# EAGLE design monkeyprintBoard (EAGLE 6.2)
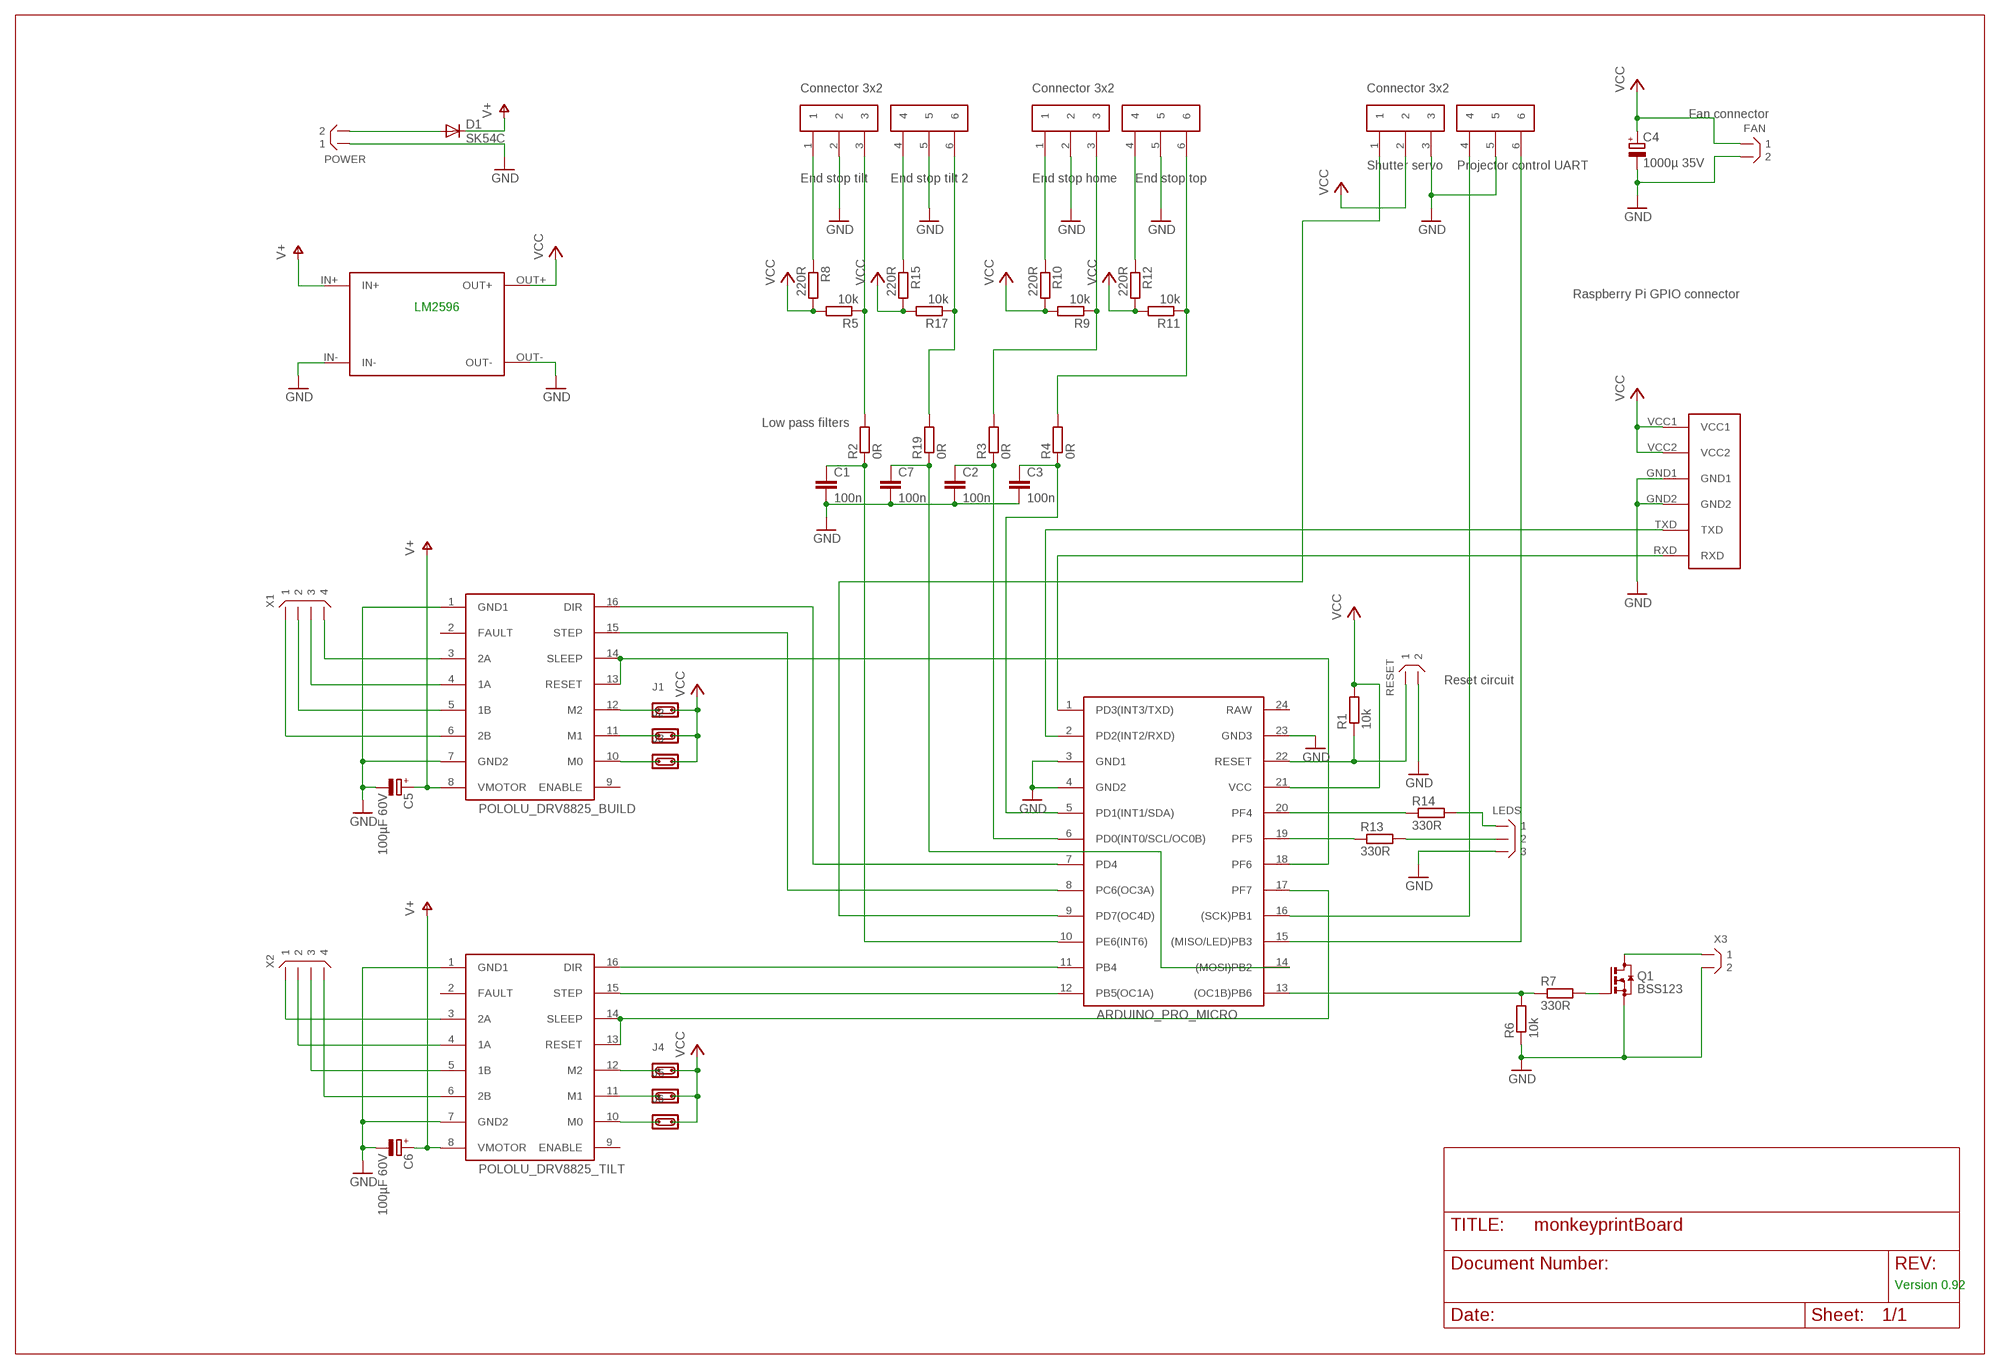
[diagram p0: schematic, sheet 1]

## Parts
ARDUINO_PRO_MICRO  ARDUINOPROMICRO  [ARDUINOPROMICRO]
C1  100n  C-EUC0603  [C0603]
C2  100n  C-EUC0603  [C0603]
C3  100n  C-EUC0603  [C0603]
C4  1000µ 35V  CPOL-EUE5-10.5  [E5-10,5]
C5  100µF 60V  CPOL-EUE5-10.5  [E5-10,5]
C6  100µF 60V  CPOL-EUE5-10.5  [E5-10,5]
C7  100n  C-EUC0603  [C0603]
D1  SK54C  DIODE-SMC  [SMC]
FAN  X02  [X02N-SIL]
J1  JP02  [JP02N]
J2  JP02  [JP02N]
J3  JP02  [JP02N]
J4  JP02  [JP02N]
J5  JP02  [JP02N]
J6  JP02  [JP02N]
LEDS  X03  [X03N-SIL]
POLOLU_DRV8825_BUILD  POLOLU8825  [POLOLU8825]
POLOLU_DRV8825_TILT  POLOLU8825  [POLOLU8825]
POWER  X02  [X02N-SIL]
Q1  BSS123  [SOT23]
R1  10k  R-EU_R0603  [R0603]
R2  0R  R-EU_R0603  [R0603]
R3  0R  R-EU_R0603  [R0603]
R4  0R  R-EU_R0603  [R0603]
R5  10k  R-EU_R0603  [R0603]
R6  10k  R-EU_R0603  [R0603]
R7  330R  R-EU_R0603  [R0603]
R8  220R  R-EU_R0603  [R0603]
R9  10k  R-EU_R0603  [R0603]
R10  220R  R-EU_R0603  [R0603]
R11  10k  R-EU_R0603  [R0603]
R12  220R  R-EU_R0603  [R0603]
R13  330R  R-EU_R0603  [R0603]
R14  330R  R-EU_R0603  [R0603]
R15  220R  R-EU_R0603  [R0603]
R17  10k  R-EU_R0603  [R0603]
R19  0R  R-EU_R0603  [R0603]
RESET  X02  [X02N-SIL]
U$1  MONKEYPRINTPICONNECTOR  [MONKEYPRINTPICONNECTOR]
U$4  LM2596MODULEUPRIGHT  [LM2596MODULEUPRIGHT]
U$5  CON3X2  [CONNECTOR3X2]
U$6  CON3X2  [CONNECTOR3X2]
U$7  CON3X2  [CONNECTOR3X2]
X1  X04  [X04N-SIL]
X2  X04  [X04N-SIL]
X3  X02  [X02N-SIL]

## Nets
GND: ARDUINO_PRO_MICRO.3(GND1) ARDUINO_PRO_MICRO.4(GND2) ARDUINO_PRO_MICRO.23(GND3) C1.2 C2.2 C3.2 C4.- C5.- C6.- C7.2 FAN.2 LEDS.3 POLOLU_DRV8825_BUILD.1(GND1) POLOLU_DRV8825_BUILD.7(GND2) POLOLU_DRV8825_TILT.1(GND1) POLOLU_DRV8825_TILT.7(GND2) POWER.1 Q1.2(S) R6.1 RESET.2 U$1.GND1 U$1.GND2 U$4.IN- U$4.OUT- U$5.2 U$5.5 U$6.2 U$6.5 U$7.3 U$7.5 X3.2
N$1: ARDUINO_PRO_MICRO.7(PD4) POLOLU_DRV8825_BUILD.16(DIR)
N$2: ARDUINO_PRO_MICRO.8(PC6(OC3A)) POLOLU_DRV8825_BUILD.15(STEP)
N$3: R2.2 R5.1 U$6.3
N$4: ARDUINO_PRO_MICRO.12(PB5(OC1A)) POLOLU_DRV8825_TILT.15(STEP)
N$5: ARDUINO_PRO_MICRO.18(PF6) POLOLU_DRV8825_BUILD.13(RESET) POLOLU_DRV8825_BUILD.14(SLEEP)
N$6: ARDUINO_PRO_MICRO.11(PB4) POLOLU_DRV8825_TILT.16(DIR)
N$7: R3.2 R9.1 U$5.3
N$8: ARDUINO_PRO_MICRO.17(PF7) POLOLU_DRV8825_TILT.13(RESET) POLOLU_DRV8825_TILT.14(SLEEP)
N$9: R4.2 R11.1 U$5.6
N$10: R8.1 U$6.1
N$11: R10.1 U$5.1
N$12: ARDUINO_PRO_MICRO.5(PD1(INT1/SDA)) C3.1 R4.1
N$13: ARDUINO_PRO_MICRO.6(PD0(INT0/SCL/OC0B)) C2.1 R3.1
N$14: R12.1 U$5.4
N$15: POLOLU_DRV8825_BUILD.3(2A) X1.4
N$16: POLOLU_DRV8825_BUILD.4(1A) X1.3
N$17: POLOLU_DRV8825_BUILD.5(1B) X1.2
N$18: POLOLU_DRV8825_TILT.3(2A) X2.1
N$19: POLOLU_DRV8825_TILT.4(1A) X2.2
N$20: POLOLU_DRV8825_TILT.5(1B) X2.3
N$21: POLOLU_DRV8825_TILT.6(2B) X2.4
N$22: J6.1 POLOLU_DRV8825_TILT.10(M0)
N$23: J5.1 POLOLU_DRV8825_TILT.11(M1)
N$24: J4.1 POLOLU_DRV8825_TILT.12(M2)
N$25: ARDUINO_PRO_MICRO.10(PE6(INT6)) C1.1 R2.1
N$26: ARDUINO_PRO_MICRO.1(PD3(INT3/TXD)) U$1.RXD
N$27: ARDUINO_PRO_MICRO.13((OC1B)PB6) R6.2 R7.1
N$28: ARDUINO_PRO_MICRO.22(RESET) R1.1 RESET.1
N$29: ARDUINO_PRO_MICRO.16((SCK)PB1) U$7.4
N$30: Q1.1(G) R7.2
N$31: Q1.3(D) X3.1
N$32: ARDUINO_PRO_MICRO.19(PF5) R13.1
N$33: ARDUINO_PRO_MICRO.21(VCC) R1.2 ; supply symbol labelled VCC
N$34: ARDUINO_PRO_MICRO.20(PF4) R14.1
N$35: LEDS.2 R13.2
N$36: LEDS.1 R14.2
N$37: ARDUINO_PRO_MICRO.2(PD2(INT2/RXD)) U$1.TXD
N$38: ARDUINO_PRO_MICRO.15((MISO/LED)PB3) U$7.6
N$39: ARDUINO_PRO_MICRO.9(PD7(OC4D)) U$7.1
N$40: D1.A POWER.2
N$41: R15.1 U$6.4
N$42: POLOLU_DRV8825_BUILD.6(2B) X1.1
N$43: C5.+ POLOLU_DRV8825_BUILD.8(VMOTOR) ; supply symbol labelled V+
N$44: J3.1 POLOLU_DRV8825_BUILD.10(M0)
N$45: J2.1 POLOLU_DRV8825_BUILD.11(M1)
N$46: J1.1 POLOLU_DRV8825_BUILD.12(M2)
N$49: R17.1 R19.2 U$6.6
N$50: ARDUINO_PRO_MICRO.14((MOSI)PB2) C7.1 R19.1
V+: C6.+ D1.C POLOLU_DRV8825_TILT.8(VMOTOR) U$4.IN+
VCC: C4.+ FAN.1 J1.2 J2.2 J3.2 J4.2 J5.2 J6.2 R5.2 R8.2 R9.2 R10.2 R11.2 R12.2 R15.2 R17.2 U$1.VCC1 U$1.VCC2 U$4.OUT+ U$7.2
Unconnected: ARDUINO_PRO_MICRO.24(RAW) POLOLU_DRV8825_BUILD.2(FAULT) POLOLU_DRV8825_BUILD.9(ENABLE) POLOLU_DRV8825_TILT.2(FAULT) POLOLU_DRV8825_TILT.9(ENABLE)

## Notes on the sheet
- Fan connector
- Shutter servo | Projector control UART
- End stop tilt | End stop tilt 2 | End stop home | End stop top
- Raspberry Pi GPIO connector
- LM2596
- Low pass filters
- Reset circuit
- Version 0.92

## Library data of the parts
ARDUINO_PRO_MICRO = arduinoProMicro:ARDUINOPROMICRO
C1-C3 C7 = rcl:C-EU: CAPACITOR, European symbol
C4-C6 = rcl:CPOL-EU: POLARIZED CAPACITOR, European symbol
D1 = diode:DIODE-: DIODE
FAN POWER RESET X3 = connectors:X02: Connector 2 pins
J1-J6 = connectors:JP02: Jumper 2 pins
LEDS = connectors:X03: Connector 3 pins
POLOLU_DRV8825_BUILD POLOLU_DRV8825_TILT = pololu8825:POLOLU8825
Q1 = transistor-small-signal:BSS123: N-CHANNEL MOS FET
R1-R15 R17 R19 = rcl:R-EU_: RESISTOR, European symbol
U$1 = monkeyprintPiConnector:MONKEYPRINTPICONNECTOR
U$4 = lm2596Module:LM2596MODULE
U$5-U$7 = connectorsPaul:CON3X2
X1 X2 = connectors:X04: Connector 4 pins

## Board
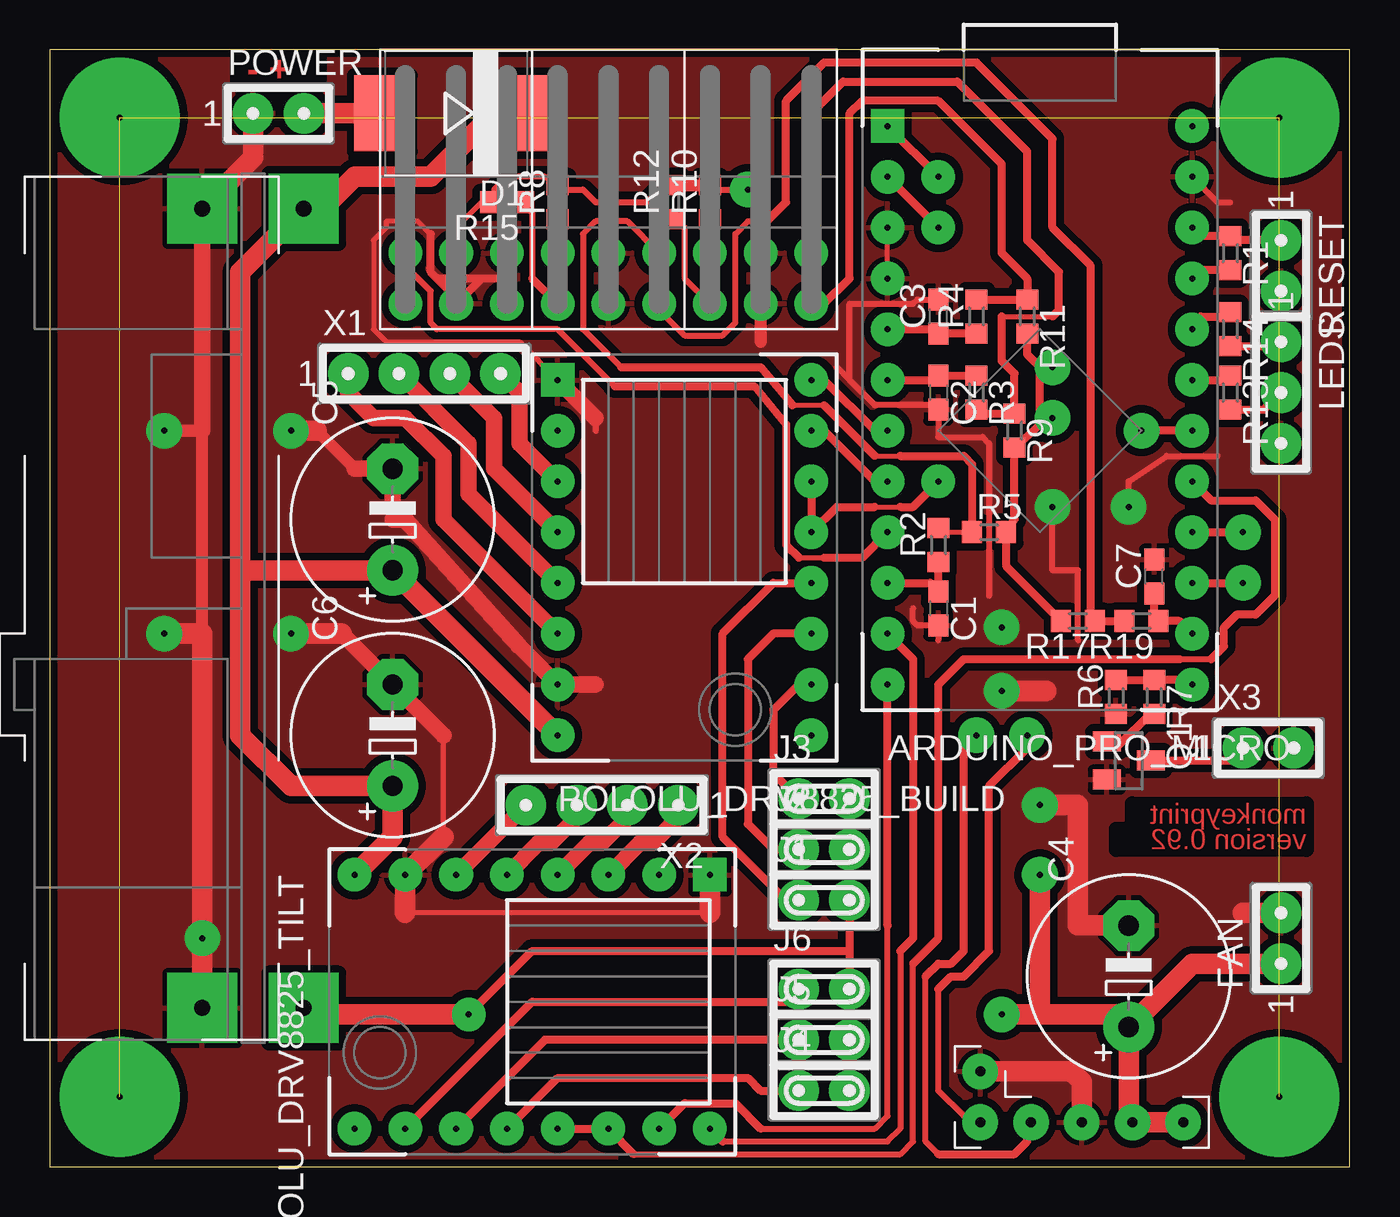
[diagram p1: board, top side]
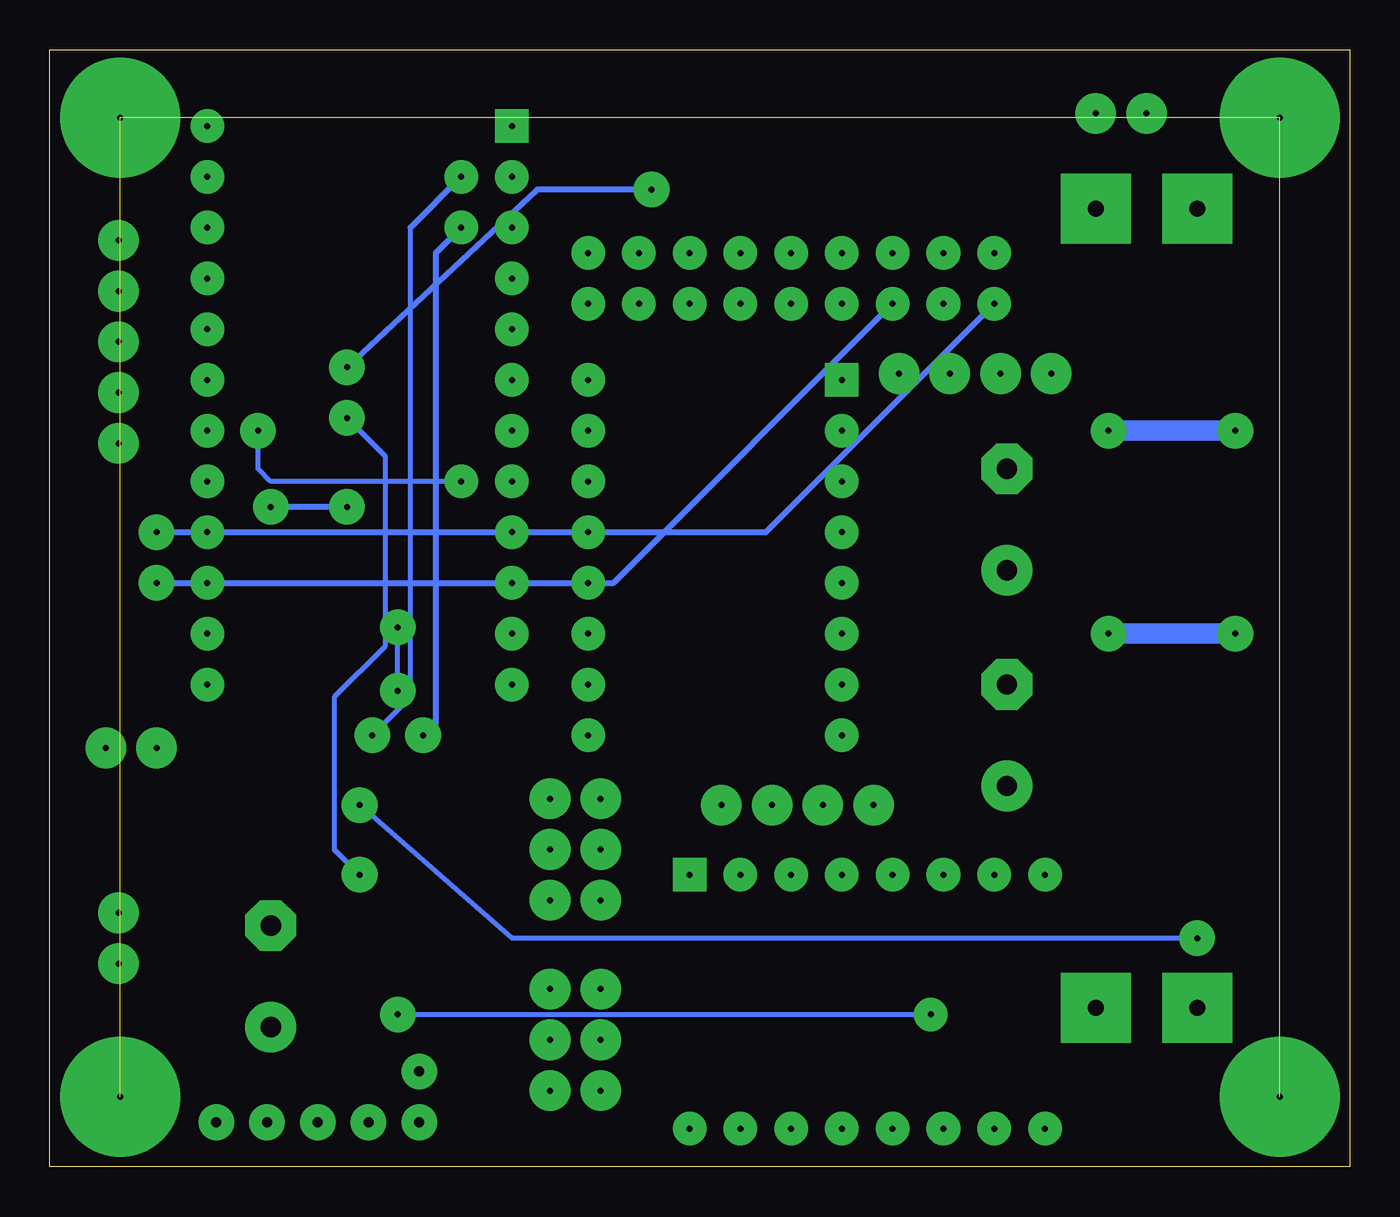
[diagram p2: board, bottom side, seen from below]

Size 65.02 x 55.88 mm. Coordinates in mm from the lower left corner, seen from the top.
Outline: 0,0 65.02,0 65.02,55.88 0,55.88 0,0
Copper layers (1*16): Top 0.035mm / dielectric 1.5mm / Bottom 0.035mm
Design rules: minimum track width 10mil, minimum drill 0.6mm, track to track 8mil, track to pad 8mil, pad to pad 8mil, via to via 8mil, smd to smd 8mil, copper to edge 10mil, drill to drill 8mil, minimum pad ring 10mil, minimum via ring 8mil, stop-mask expansion 4mil, vias tented up to drill 0mil, thermal gap 10mil
tRestrict: area 9.5,54.3 to 13.3,55.6

### Footprints (pad centres in the part's own frame; a part is rotated, then mirrored left to right if it is on the bottom)
ARDUINOPROMICRO = drill 0.3 pad 1.676 square: 1 -7.62,12.7 | drill 0.3 pad 1.676: 2 -7.62,10.16; 3 -7.62,7.62; 4 -7.62,5.08; 5 -7.62,2.54; 6 -7.62,0; 7 -7.62,-2.54; 8 -7.62,-5.08; 9 -7.62,-7.62; 10 -7.62,-10.16; 11 -7.62,-12.7; 12 -7.62,-15.24; 13 7.62,-15.24; 14 7.62,-12.7; 15 7.62,-10.16; 16 7.62,-7.62; 17 7.62,-5.08; 18 7.62,-2.54; 19 7.62,0; 20 7.62,2.54; 21 7.62,5.08; 22 7.62,7.62; 23 7.62,10.16; 24 7.62,12.7
C0603 = smd 1.1 x 1: 1 -0.85,0; 2 0.85,0
E5-10,5 = drill 1.016 pad 2.54: + -2.54,0 | drill 1.016 pad 2.54 octagon: - 2.54,0
SMC = smd 2.8 x 3.8: A 3.7,0; C -3.7,0
X02N-SIL = drill 0.3 pad 2.032: 1 -1.27,0; 2 1.27,0
JP02N = drill 0.3 pad 2.032: 1 -1.27,0; 2 1.27,0
X03N-SIL = drill 0.3 pad 2.032: 1 -2.54,0; 2 0,0; 3 2.54,0
POLOLU8825 = drill 0.3 pad 1.676 square: 1 -6.35,8.89 | drill 0.3 pad 1.676: 2 -6.35,6.35; 3 -6.35,3.81; 4 -6.35,1.27; 5 -6.35,-1.27; 6 -6.35,-3.81; 7 -6.35,-6.35; 8 -6.35,-8.89; 9 6.35,-8.89; 10 6.35,-6.35; 11 6.35,-3.81; 12 6.35,-1.27; 13 6.35,1.27; 14 6.35,3.81; 15 6.35,6.35; 16 6.35,8.89
SOT23 = smd 1 x 1.4: 1 -0.95,-1.1; 2 0.95,-1.1; 3 0,1.1
R0603 = smd 1 x 1.1: 1 -0.85,0; 2 0.85,0
MONKEYPRINTPICONNECTOR = drill 0.5 pad 1.778: GND1 0,-1.27; GND2 -5.08,1.27; RXD -5.08,-1.27; TXD -2.54,-1.27; VCC1 5.08,-1.27; VCC2 2.54,-1.27
LM2596MODULEUPRIGHT = drill 0.8 pad 3.5 square: IN+ -20,2.54 | drill 0.8 pad 3.505 square: IN- -20,-2.54; OUT+ 20,2.54; OUT- 20,-2.54
CONNECTOR3X2 = drill 0.3 pad 1.676: 1 -2.54,0; 2 0,0; 3 2.54,0; 4 -2.54,-2.54; 5 0,-2.54; 6 2.54,-2.54
X04N-SIL = drill 0.3 pad 2.032: 1 -3.81,0; 2 -1.27,0; 3 1.27,0; 4 3.81,0

### Placement (x,y rotation side)
ARDUINO_PRO_MICRO  49.53,39.37 0 top
C1  44.45,27.94 270 top
C2  44.45,38.73 270 top
C3  44.45,42.55 90 top
C4  53.98,9.53 90 top
C5  17.14,32.38 90 top
C6  17.14,21.59 90 top
C7  55.24,29.53 90 top
D1  20.32,52.7 180 top
FAN  61.59,11.43 90 top
J1  38.73,13.34 0 top
J2  38.73,15.88 0 top
J3  38.73,18.41 0 top
J4  38.73,3.81 0 top
J5  38.73,6.35 0 top
J6  38.73,8.89 0 top
LEDS  61.59,38.73 270 top
POLOLU_DRV8825_BUILD  31.75,30.48 0 top
POLOLU_DRV8825_TILT  24.13,8.26 270 top
POWER  11.43,52.7 0 top
Q1  53.98,20.32 270 top
R1  59.05,45.72 270 top
R2  44.45,31.11 90 top
R3  46.35,38.73 270 top
R4  46.35,42.55 90 top
R5  46.99,31.75 0 top
R6  53.34,23.5 90 top
R7  55.24,23.5 270 top
R8  25.4,48.26 90 top
R9  48.26,36.83 270 top
R10  33.02,48.26 90 top
R11  48.9,42.55 270 top
R12  31.11,48.26 90 top
R13  59.05,38.73 270 top
R14  59.05,41.91 270 top
R15  22.86,48.26 180 top
R17  51.44,27.3 180 top
R19  54.61,27.3 180 top
RESET  61.59,45.09 270 top
U$1  51.63,3.49 0 top
U$4  10.16,27.94 270 top
U$5  35.56,45.72 0 top
U$6  27.94,45.72 0 top
U$7  20.32,45.72 0 top
X1  18.73,39.69 0 top
X2  27.62,18.1 180 top
X3  60.96,20.95 0 top

### Tracks (layer width: path | path; a pad name or v marks a point on that pad's centre or on a via)
GND  (via drill 0.3 pad 1.78)
  Top 0.254: ARDUINO_PRO_MICRO.4 ARDUINO_PRO_MICRO.3 | 33.02,12.7 17.78,12.7 | 19.68,16.51 19.68,21.59 | 17.14,32.38 17.14,33.02 | POWER.1 10.16,50.48 | U$5.2 U$5.5 | U$4.OUT- 7.62,8.26 | U$7.5 20.32,43.5 | 19.05,46.67 18.41,47.31 16.83,47.31 16.83,46.99 16.19,46.35 16.19,41.91 16.83,41.27 23.5,41.27 POLOLU_DRV8825_BUILD.1
  Top 0.305: 40.01,39.37 41.27,38.1 44.23,38.1 C2.2 44.45,36.51 46.67,36.51 46.99,36.2 46.99,28.57 | 40.01,39.37 40.01,43.18 43.18,43.18 43.4,43.4 C3.2 | 40.01,39.37 39.37,40.01 | 43.18,27.94 43.18,27.3 43.4,27.09 C1.2 44.45,26.35 | 58.42,35.56 55.88,35.56 53.98,34.29 v53.98,33.02 | 60.33,36.2 LEDS.3 | 27.3,37.47 27.3,36.83 | ARDUINO_PRO_MICRO.23 58.42,48.26 59.05,48.26 | 51.44,26.35 51.44,29.84 50.16,29.84 v50.16,33.02
  Top 0.406: 19.37,44.45 20.32,43.5 20.64,43.5 21.59,44.45 | 19.37,44.45 19.05,44.77 19.05,46.67 | U$7.3 22.86,44.45 19.37,44.45
  Top 0.61: 15.24,34.92 13.34,36.83 | v5.71,36.83 7.62,36.83 7.62,26.67 | U$5.5 35.56,41.27 | U$6.5 U$6.2
  Top 0.813: 27.3,24.13 POLOLU_DRV8825_BUILD.7 23.5,26.04 17.78,32.38 17.14,32.38 | 17.14,33.02 C5.- 15.24,34.92 | U$4.IN- 7.62,36.83 | 19.68,21.59 C6.- 14.61,26.67 | POLOLU_DRV8825_BUILD.1 27.3,37.47
  Top 1.016: POLOLU_DRV8825_TILT.1 33.02,12.7 | 17.78,12.7 POLOLU_DRV8825_TILT.7 19.68,16.51 | 10.16,50.48 U$4.IN- | 13.34,36.83 v12.06,36.83 | 14.61,26.67 v12.06,26.67 | v5.71,26.67 7.62,26.67 U$4.OUT- | U$1.GND2 51.12,4.76 51.63,4.25 U$1.GND1 | v49.53,18.1 51.44,18.1 51.44,12.06 C4.- | FAN.2 59.69,12.7 | POWER.1 10.16,50.8 | v47.62,23.81 49.85,23.81
  Bottom 0.254: v7.62,11.43 41.91,11.43 v49.53,18.1 | v47.62,23.81 v47.62,26.99
  Bottom 0.305: v50.16,33.02 v53.98,33.02
  Bottom 1.016: v12.06,36.83 v5.71,36.83 | v12.06,26.67 v5.71,26.67
  pour Top (isolate 0.381): -0.64,-0.64 65.41,-0.64 65.41,56.52 -0.64,56.52
N$1
  Top 0.406: POLOLU_DRV8825_BUILD.16 38.73,39.37 41.27,36.83 ARDUINO_PRO_MICRO.7
N$2
  Top 0.406: POLOLU_DRV8825_BUILD.15 38.73,36.83 41.27,34.29 ARDUINO_PRO_MICRO.8
N$3
  Top 0.254: 37.15,38.1 38.73,38.1 | 41.27,35.56 42.55,35.56 | R2.2 44.66,31.75 R5.1
  Top 0.305: U$6.3 28.89,47.31 27.3,47.31 26.67,46.67 26.67,41.91 28.57,40.01
  Top 0.406: 28.57,40.01 35.56,40.01 37.15,38.1 | 38.73,38.1 41.27,35.56 | 42.55,35.56 45.72,35.56 46.14,35.14 R5.1
N$4
  Top 0.305: 35.56,1.91 41.27,1.91 41.91,2.54 41.91,12.06
  Top 0.406: POLOLU_DRV8825_TILT.15 31.75,3.17 34.29,3.17 35.56,1.91 | 41.91,12.06 ARDUINO_PRO_MICRO.12
N$5  (via drill 0.3 pad 1.68, 0.3 pad 1.78)
  Top 0.254: 41.27,33.02 42.55,33.02
  Top 0.406: ARDUINO_PRO_MICRO.18 v54.61,36.83 | POLOLU_DRV8825_BUILD.14 POLOLU_DRV8825_BUILD.13 39.37,33.02 41.27,33.02 | 42.55,33.02 43.18,33.02 v44.45,34.29
  Bottom 0.254: v44.45,34.29 53.98,34.29 54.61,34.92 v54.61,36.83
N$6
  Top 0.305: 33.66,1.27 41.91,1.27 42.55,1.91 42.55,10.79
  Top 0.406: POLOLU_DRV8825_TILT.16 33.66,1.27 | ARDUINO_PRO_MICRO.11 43.18,25.4 43.18,11.43 42.55,10.79
N$7
  Top 0.254: 47.62,42.55 50.16,42.55
  Top 0.406: U$5.3 38.1,52.7 39.69,54.29 45.4,54.29 48.9,50.8 48.9,46.35 50.48,44.77 50.48,42.86 50.16,42.55 | R9.1 48.26,39.69 47.62,40.32 47.62,42.55 | R3.2 46.56,37.68 R9.1 | R9.1 48.26,37.47
N$8
  Top 0.305: 29.21,0.64 42.55,0.64 43.18,1.27 43.18,10.16 | 56.52,25.4 58.1,25.4
  Top 0.406: POLOLU_DRV8825_TILT.13 POLOLU_DRV8825_TILT.14 29.21,0.64 | 43.18,10.16 44.45,11.43 44.45,24.13 45.72,25.4 56.52,25.4 | 58.1,25.4 58.74,26.04 58.74,26.99 59.37,27.62 60.33,27.62 61.28,28.57 61.28,32.38 60.33,33.34 58.1,33.34 ARDUINO_PRO_MICRO.17
N$9
  Top 0.406: U$5.6 38.73,43.18 40.01,44.45 40.01,52.7 40.64,53.34 44.45,53.34 47.62,50.16 47.62,45.72 48.9,44.45 R11.1 R4.2
N$10
  Top 0.305: R8.1 U$6.1
N$11
  Top 0.305: R10.1 U$5.1
N$12
  Top 0.254: 44.23,41.91 C3.1
  Top 0.406: ARDUINO_PRO_MICRO.5 44.23,41.91 | R4.1 C3.1
N$13
  Top 0.254: 44.03,39.37 C2.1
  Top 0.406: ARDUINO_PRO_MICRO.6 44.03,39.37 | C2.1 R3.1
N$14
  Top 0.305: R12.1 30.8,47.62 31.11,47.62 31.75,46.99 31.75,44.45 U$5.4
N$15
  Top 0.813: X1.4 23.5,38.73 23.5,36.2 POLOLU_DRV8825_BUILD.3
N$16
  Top 0.813: X1.3 22.23,37.47 22.23,34.92 POLOLU_DRV8825_BUILD.4
N$17
  Top 0.813: X1.2 20.95,36.2 20.95,33.66 POLOLU_DRV8825_BUILD.5
N$18
  Top 0.813: X2.1 31.43,17.46 30.16,16.19 29.53,16.19 POLOLU_DRV8825_TILT.3
N$19
  Top 0.813: X2.2 28.89,17.46 27.62,16.19 26.99,16.19 POLOLU_DRV8825_TILT.4
N$20
  Top 0.813: X2.3 26.35,17.46 25.08,16.19 24.45,16.19 POLOLU_DRV8825_TILT.5
N$21
  Top 0.813: POLOLU_DRV8825_TILT.6 X2.4
N$22
  Top 0.406: POLOLU_DRV8825_TILT.10 24.13,8.26 36.83,8.26 J6.1
N$23
  Top 0.406: J5.1 24.77,6.35 POLOLU_DRV8825_TILT.11
N$24
  Top 0.406: POLOLU_DRV8825_TILT.12 25.4,4.45 34.92,4.45 35.56,3.81 J4.1
N$25
  Top 0.254: 44.03,29.21 C1.1
  Top 0.406: ARDUINO_PRO_MICRO.10 44.03,29.21 | C1.1 R2.1
N$26  (via drill 0.3 pad 1.68, 0.3 pad 1.78)
  Top 0.305: 44.45,8.89 44.45,3.81 45.72,2.54 46.23,2.54 U$1.RXD
  Top 0.406: 44.45,8.89 45.09,9.53 45.72,9.53 46.99,10.79 46.99,19.05 48.9,20.95 v48.9,21.59 | ARDUINO_PRO_MICRO.1 v44.45,49.53
  Bottom 0.254: v48.9,21.59 46.99,23.5 46.99,46.99
  Bottom 0.305: v44.45,49.53 46.99,46.99
N$27
  Top 0.406: R6.2 R7.1 56.94,24.34 ARDUINO_PRO_MICRO.13
N$28
  Top 0.305: 59.27,46.35 R1.1
  Top 0.406: R1.1 57.57,46.57 ARDUINO_PRO_MICRO.22 | RESET.1 59.27,46.35
N$29  (via drill 0.3 pad 1.78)
  Top 0.406: ARDUINO_PRO_MICRO.16 v59.69,31.75
  Bottom 0.305: v59.69,31.75 29.21,31.75 U$7.4
N$30
  Top 0.305: Q1.1 53.19,21.59 53.34,20.95 | 55.24,22.86 R7.2
  Top 0.406: 53.34,20.95 55.24,22.86
N$31
  Top 0.406: Q1.3 59.05,20.32 X3.1
N$32
  Top 0.406: ARDUINO_PRO_MICRO.19 58.63,39.37 R13.1
N$33
  Top 0.406: R1.2 57.57,44.87 ARDUINO_PRO_MICRO.21
N$34
  Top 0.406: ARDUINO_PRO_MICRO.20 57.57,42.55 58.84,42.55 R14.1
N$35
  Top 0.406: R13.2 60.74,37.88 LEDS.2
N$36
  Top 0.406: R14.2 61.17,41.06 LEDS.1
N$37  (via drill 0.3 pad 1.68, 0.3 pad 1.78)
  Top 0.305: 43.81,9.53 43.81,1.27 44.45,0.64 | 48.9,2.03 U$1.TXD
  Top 0.406: 43.81,9.53 44.45,10.16 45.09,10.16 45.72,10.79 45.72,20.95 v46.35,21.59 | ARDUINO_PRO_MICRO.2 v44.45,46.99 | 44.45,0.64 48.26,0.64 48.9,1.27 48.9,2.03
  Bottom 0.305: v44.45,46.99 45.72,45.72 45.72,22.23 v46.35,21.59
N$38  (via drill 0.3 pad 1.78)
  Top 0.406: ARDUINO_PRO_MICRO.15 v59.69,29.21
  Bottom 0.305: v59.69,29.21 36.83,29.21 U$7.6
N$39
  Top 0.254: 37.47,30.48 38.73,30.48
  Top 0.305: 28.26,39.05 25.4,41.91 19.37,41.91 19.05,42.23 19.05,43.81 17.78,45.09 U$7.1
  Top 0.406: 28.26,39.05 35.24,39.05 36.83,37.15 36.83,31.11 37.47,30.48 | 38.73,30.48 40.64,30.48 ARDUINO_PRO_MICRO.9
N$40
  Top 1.016: D1.A POWER.2
N$41
  Top 0.305: 24.13,44.45 24.13,47.73 R15.1
  Top 0.406: 24.13,44.45 U$6.4
N$42
  Top 0.813: X1.1 14.92,38.73 16.19,37.47 17.78,37.47 19.68,35.56 19.68,32.38 POLOLU_DRV8825_BUILD.6
N$43
  Top 1.016: 9.53,29.84 C5.+ POLOLU_DRV8825_BUILD.8
N$44
  Top 0.406: POLOLU_DRV8825_BUILD.10 37.47,24.13 36.2,22.86 36.2,20.32 36.2,19.68 J3.1
N$45
  Top 0.406: POLOLU_DRV8825_BUILD.11 36.2,26.67 34.92,25.4 34.92,17.14 36.2,15.88 J2.1
N$46
  Top 0.406: J1.1 36.83,13.34 33.66,16.51 33.66,26.67 36.2,29.21 POLOLU_DRV8825_BUILD.12
N$47  (via drill 0.3 pad 6)  (3 unrouted)
  other vias: 61.5,52.5 61.5,3.5 3.5,3.5 3.5,52.5
N$49
  Top 0.305: U$6.6 30.48,42.86 31.75,41.59 33.66,41.59 34.29,42.23 34.29,46.67 34.92,47.31 35.88,47.31
  Top 0.406: R19.2 R17.1 52.07,27.52 52.07,45.09 50.16,46.99 50.16,51.44 46.35,55.24 38.73,55.24 36.83,53.34 36.83,48.26 35.88,47.31
N$50
  Top 0.406: ARDUINO_PRO_MICRO.14 56.52,27.3 R19.1 55.24,27.3 C7.1
V+
  Top 1.016: POLOLU_DRV8825_TILT.8 17.14,16.51 C6.+ 12.06,19.05 9.53,21.59 9.53,44.77 U$4.IN+ 13.02,48.26 13.97,48.26 15.24,49.53 19.05,49.53 22.23,52.7 D1.C
VCC  (via drill 0.3 pad 1.68, 0.3 pad 1.78)
  Top 0.254: 13.02,7.62 U$4.OUT+ | R15.2 21.59,48.26 20.32,46.99 U$7.2
  Top 0.305: R15.2 22.23,48.26 22.23,48.9 22.86,49.53 24.77,49.53 R8.2 25.18,49.11 25.4,48.9 26.67,48.9 27.3,48.26 29.84,48.26 30.48,48.9 31.11,48.9 R12.2 | R10.2 33.02,48.9 v34.92,48.9
  Top 0.406: J4.2 J5.2 J6.2 40.01,10.79 | J3.2 J2.2 J1.2 40.01,10.79 | v20.95,7.62 24.13,10.79 40.01,10.79 | 49.53,37.47 49.53,37.15 R9.2 48.26,32.38 R5.2 47.83,30.06 R17.2 | 49.53,37.47 49.53,40.01 | 49.53,40.01 48.9,40.64 R11.2 | v50.16,40.01 49.53,40.01 | v50.16,37.47 49.53,37.47
  Top 0.61: R12.2 R10.2
  Top 0.813: 53.98,6.35 C4.+
  Top 1.016: v20.95,7.62 13.02,7.62 | 49.53,7.62 53.34,7.62 C4.+ 57.15,10.16 FAN.1 | 53.98,6.35 53.98,2.41 U$1.VCC2 U$1.VCC1 | v47.62,7.62 49.53,7.62 | 49.53,7.62 v49.53,14.61
  Bottom 0.254: v47.62,7.62 v20.95,7.62 | v50.16,37.47 48.26,35.56 48.26,26.04 50.8,23.5 50.8,15.88 v49.53,14.61
  Bottom 0.305: v34.92,48.9 40.64,48.9 v50.16,40.01

### Text on the board
Top: - + | monkeyprint | version 0.92
tRestrict: monkeyprint | version 0.9